# EAGLE schematic brick_serial_wisun (EAGLE 7.2.0)
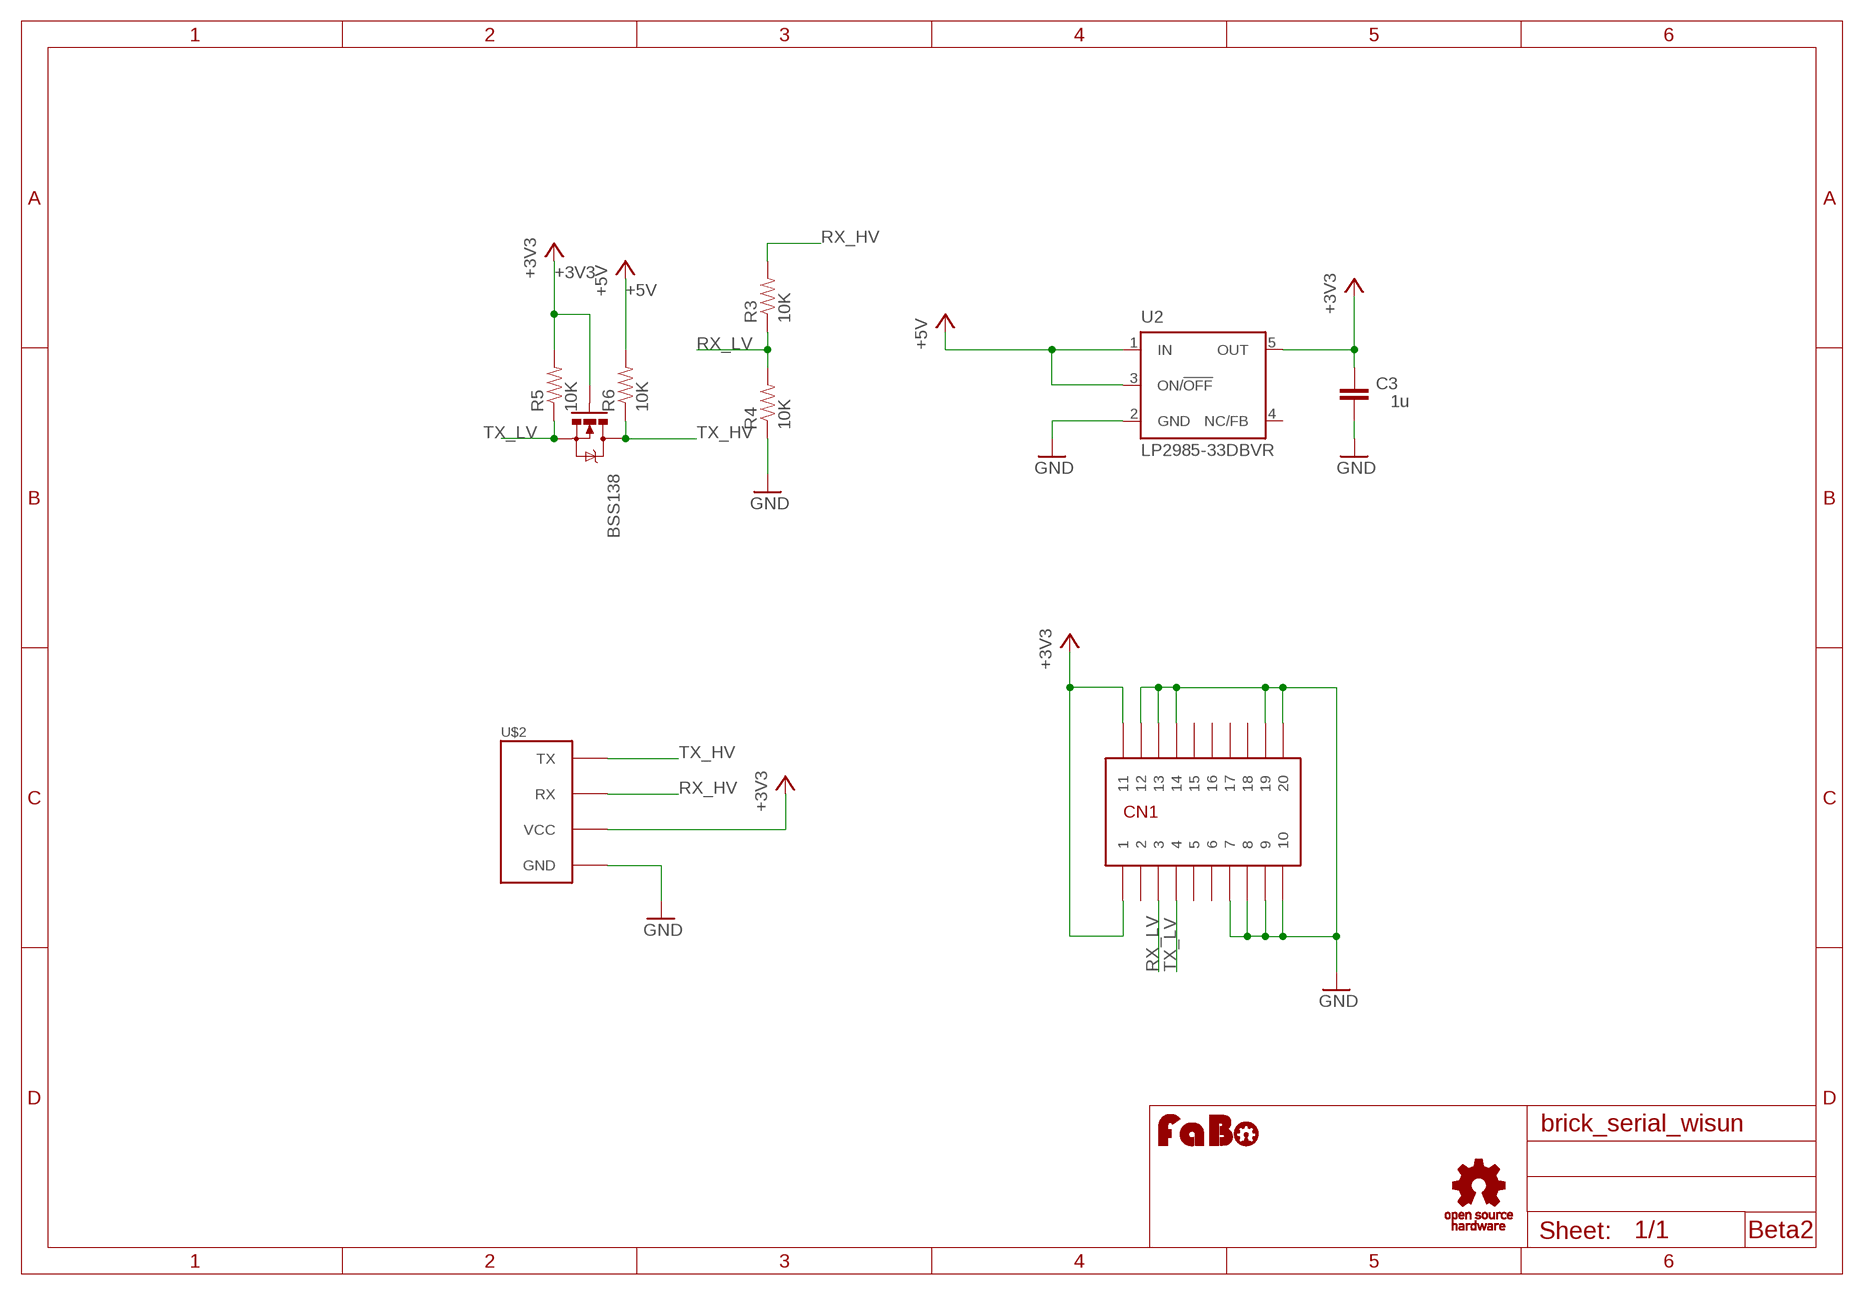
[diagram p0: schematic, sheet 1]

## Parts
BSS138  MOSFET-NCHANNELSMD  [SOT23-3]
C3  1u  C-EU0603-RND  [C0603-ROUND]
CN1  JST-20P3.0-JMCS  [JST-20P3.0-JMCS]
R3  10K  RESISTOR0603-RES  [0603-RES]
R4  10K  RESISTOR0603-RES  [0603-RES]
R5  10K  RESISTOR0603-RES  [0603-RES]
R6  10K  RESISTOR0603-RES  [0603-RES]
U2  LP2985-33DBVR  LP2985-XXDBVR33  [SOT23-DBV]
U$1  LOGO_OSHW_T-S  [LOGO_OSHW_T_S]
U$2  BRICK_SERIAL  [BRICK_SERIAL]
U$4  LOGO_FABO-S  [LOGO_FABO_S]

## Nets
+3V3: BSS138.1(G) C3.2 CN1.10 CN1.20 R5.2 U2.5(OUT) U$2.VCC
+5V: R6.2 U2.1(IN) U2.3(ON/!OFF)
GND: C3.1 CN1.1 CN1.2 CN1.3 CN1.4 CN1.11 CN1.12 CN1.17 CN1.18 CN1.19 R4.1 U2.2(GND) U$2.GND
RX_HV: R3.2 U$2.RX
RX_LV: CN1.8 R3.1 R4.2
TX_HV: BSS138.3(D) R6.1 U$2.TX
TX_LV: BSS138.2(S) CN1.7 R5.1
Unconnected: CN1.5 CN1.6 CN1.9 CN1.13 CN1.14 CN1.15 CN1.16 U2.4(NC/FB)

## Notes on the sheet
- Beta2

## Library data of the parts
BSS138 = SparkFun:MOSFET-NCHANNEL
C3 = SmartPrj:C-EU: CAPACITOR, European symbol
CN1 = gclueParts:JST-20P3.0-JMCS
R3-R6 = SparkFun:RESISTOR: Resistor Basic schematic elements and footprints for 0603, 1206, and PTH resistors.
U2 = SmartPrj:LP2985-XXDBVR: ULTRALOW-POWER 50-mA LOW-DROPOUT LINEAR REGULATORS 50-mA Low-Dropout Regulator Source: http://focus.ti.com/lit/ds/symlink/tps77001.pdf
U$1 = gclue:LOGO_OSHW_T
U$2 = gclue:BRICK_SERIAL: FaBo Brick 4pin(SERIAL)
U$4 = FaBo:LOGO_FABO